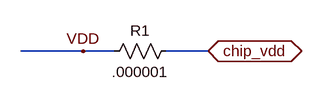
[diagram p0: schematic chip_vdd.asc]
chip_vdd.asc, the LTspice schematic file:
Version 4
SHEET 1 880 680
WIRE 0 208 -96 208
WIRE 48 208 0 208
WIRE 192 208 128 208
FLAG 192 208 chip_vdd
IOPIN 192 208 BiDir
FLAG 0 208 VDD
SYMBOL res 144 192 R90
WINDOW 0 0 56 VBottom 2
WINDOW 3 32 56 VTop 2
SYMATTR InstName R1
SYMATTR Value .000001

The netlist it stands for:
* chip_vdd.asc
R1 chip_vdd VDD .000001
.backanno
.end